# Altium project Auto-Solar-Cleaner.PrjPcb
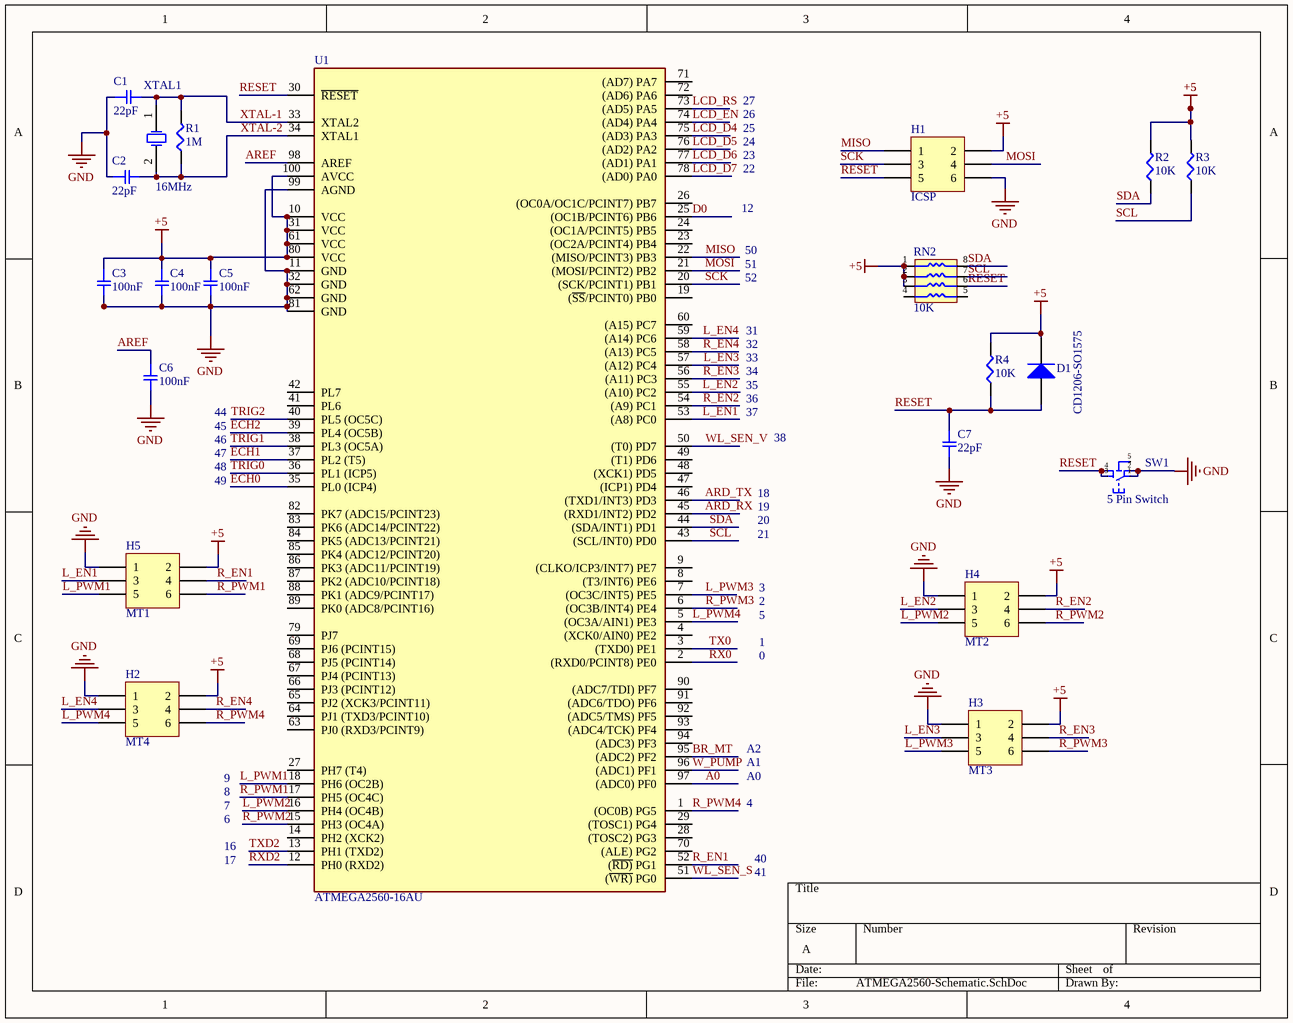
[diagram p0: ATMEGA2560-Schematic.SchDoc]
4 sheets, 90 parts. Net scope: global (net labels, ports and power ports of the same name join across sheets).
Board file: SOLAR_CLEANER_PCB.PcbDoc
Sheets:
  ATMEGA2560-Schematic.SchDoc
  CH340-Sch.SchDoc
  ESP01-Schematic.SchDoc
  Sensors.SchDoc

## Sheet ATMEGA2560-Schematic.SchDoc
size A

### Parts
C1  22pF
C2  22pF
C3  100nF  [SMD-0805C]
C4  100nF  [SMD-0805C]
C5  100nF  [SMD-0805C]
C6  100nF  [SMD-0805C]
C7  22pF  [SMD-0603C]
D1  CD1206-SO1575  [D1206-RD]
H1  ICSP  [HDR2X3]
H2  MT4  [HDR2X3]
H3  MT3  [HDR2X3]
H4  MT2  [HDR2X3]
H5  MT1  [HDR2X3]
R1  1M  [SMD-0805-RES]
R2  10K
R3  10K
R4  10K
RN2  10K  [RA0603-8]
SW1  5 Pin Switch  [SPDT-5Pin]
U1  ATMEGA2560-16AU  [TQFP-100(LCSC)]
XTAL1  16MHz

### Nets
+5: C3.1 C4.1 C5.1 D1.2(K) H1.2 H2.2 H3.2 H4.2 H5.2 R2.2 R3.2 R4.2 RN2.1 RN2.2 RN2.3 U1.10(VCC) U1.31(VCC) U1.61(VCC) U1.80(VCC) U1.100(AVCC)
GND: C1.1 C2.1 C3.2 C4.2 C5.2 C6.2 C7.2 H1.6 H2.1 H3.1 H4.1 H5.1 SW1.1 SW1.2 U1.11(GND) U1.32(GND) U1.62(GND) U1.81(GND) U1.99(AGND)
A0: U1.97((ADC0)_PF0)
ARD_RX: U1.45((RXD1/INT2)_PD2)
ARD_TX: U1.46((TXD1/INT3)_PD3)
AREF: C6.1 U1.98(AREF)
BR_MT: U1.95((ADC2)_PF2)
D0: U1.25((OC1B/PCINT6)_PB6)
ECH0: U1.35(PL0_(ICP4))
ECH1: U1.37(PL2_(T5))
ECH2: U1.39(PL4_(OC5B))
L_EN1: H5.3 U1.53((A8)_PC0)
L_EN2: H4.3 U1.55((A10)_PC2)
L_EN3: H3.3 U1.57((A12)_PC4)
L_EN4: H2.3 U1.59((A14)_PC6)
L_PWM1: H5.5 U1.18(PH6_(OC2B))
L_PWM2: H4.5 U1.16(PH4_(OC4B))
L_PWM3: H3.5 U1.7((OC3C/INT5)_PE5)
L_PWM4: H2.5 U1.5((OC3A/AIN1)_PE3)
LCD_D4: U1.75((AD3)_PA3)
LCD_D5: U1.76((AD2)_PA2)
LCD_D6: U1.77((AD1)_PA1)
LCD_D7: U1.78((AD0)_PA0)
LCD_EN: U1.74((AD4)_PA4)
LCD_RS: U1.73((AD5)_PA5)
MISO: H1.1 U1.22((MISO/PCINT3)_PB3)
MOSI: H1.4 U1.21((MOSI/PCINT2)_PB2)
R_EN1: H5.4 U1.52((~{RD)}_PG1)
R_EN2: H4.4 U1.54((A9)_PC1)
R_EN3: H3.4 U1.56((A11)_PC3)
R_EN4: H2.4 U1.58((A13)_PC5)
R_PWM1: H5.6 U1.17(PH5_(OC4C))
R_PWM2: H4.6 U1.15(PH3_(OC4A))
R_PWM3: H3.6 U1.6((OC3B/INT4)_PE4)
R_PWM4: H2.6 U1.1((OC0B)_PG5)
RESET: C7.1 D1.1(A) H1.5 R4.1 RN2.6 SW1.3 SW1.4 U1.30(~{RESET})
RX0: U1.2((RXD0/PCINT8)_PE0)
RXD2: U1.12(PH0_(RXD2))
SCK: H1.3 U1.20((SCK/PCINT1)_PB1)
SCL: R3.1 RN2.7 U1.43((SCL/INT0)_PD0)
SDA: R2.1 RN2.8 U1.44((SDA/INT1)_PD1)
TRIG0: U1.36(PL1_(ICP5))
TRIG1: U1.38(PL3_(OC5A))
TRIG2: U1.40(PL5_(OC5C))
TX0: U1.3((TXD0)_PE1)
TXD2: U1.13(PH1_(TXD2))
W_PUMP: U1.96((ADC1)_PF1)
WL_SEN_S: U1.51((~{WR)}_PG0)
WL_SEN_V: U1.50((T0)_PD7)
XTAL-1: C1.2 R1.2 U1.33(XTAL2) XTAL1.1(OSC1)
XTAL-2: C2.2 R1.1 U1.34(XTAL1) XTAL1.2(OSC2)

Not connected (* = marked no-connect by the designer): RN2 4 5; SW1 5; U1 4((XCK0/AIN0)_PE2) 8((T3/INT6)_PE6) 9((CLKO/ICP3/INT7)_PE7) 14(PH2_(XCK2)) 19((~{SS}/PCINT0)_PB0) 23((OC2A/PCINT4)_PB4) 24((OC1A/PCINT5)_PB5) 26((OC0A/OC1C/PCINT7)_PB7) 27(PH7_(T4)) 28((TOSC2)_PG3) 29((TOSC1)_PG4) 41(PL6) 42(PL7) 47((ICP1)_PD4) 48((XCK1)_PD5) 49((T1)_PD6) 60((A15)_PC7) 63(PJ0_(RXD3/PCINT9)) 64(PJ1_(TXD3/PCINT10)) 65(PJ2_(XCK3/PCINT11)) 66(PJ3_(PCINT12)) 67(PJ4_(PCINT13)) 68(PJ5_(PCINT14)) 69(PJ6_(PCINT15)) 70((ALE)_PG2) 71((AD7)_PA7) 72((AD6)_PA6) 79(PJ7) 82(PK7_(ADC15/PCINT23)) 83(PK6_(ADC14/PCINT22)) 84(PK5_(ADC13/PCINT21)) 85(PK4_(ADC12/PCINT20)) 86(PK3_(ADC11/PCINT19)) 87(PK2_(ADC10/PCINT18)) 88(PK1_(ADC9/PCINT17)) 89(PK0_(ADC8/PCINT16)) 90((ADC7/TDI)_PF7) 91((ADC6/TDO)_PF6) 92((ADC5/TMS)_PF5) 93((ADC4/TCK)_PF4) 94((ADC3)_PF3)

### Notes on the sheet
- 23
- 24
- 25
- 26
- 27
- 12
- 22
- 52
- 51
- 50
- 33
- 32
- 31
- 45
- 44
- 37
- 36
- 35
- 34
- 49
- 48
- 47
- 46
- 18
- 38
- 21
- 20
- 19
- 5
- 2
- 3
- 0
- 1
- A1
- A2
- 6
- 7
- 8
- 9
- 4
- A0
- 17
- 16
- 41
- 40

### Library data of the parts
C1-C7 = GC321AD72E103KX01D: CAP CER 10000PF 250V X7T 0805; Manufacturer: Murata Electronics North America; Factory Stock: 0; Unit Price (USD): 0.3; Minimum Quantity: 1; Tolerance: ±10%; Datasheets: http://search.murata.co.jp/Ceramy/image/img/A01X/G101/ENG/GC321AD72E103KX01-01.pdf; Image: //media.digikey.com/Renders/Murata%20Renders/0805(GC3)200x125.jpg; Digi-Key Part Number: 490-13986-1-ND; Part Number: GC321AD72E103KX01D; Quantity Available: 4000; @ qty: 0; Packaging: Cut Tape (CT); Series: GC3; Part Status: Active; Value: 10000pF; Voltage: 250V; Temperature Coefficient: X7T; Operating Temperature: -55°C ~ 125°C; Features: -; Ratings: AEC-Q200; Applications: Automotive; Mounting Type: Surface Mount, MLCC; Package / Case: 0805 (2012 Metric); Size / Dimension: 0.079" L x 0.049" W (2.00mm x 1.25mm); Height - Seated (Max): -; Thickness (Max): 0.039" (1.00mm); Lead Spacing: -; Lead Style: -
D1 = Diode: Default Diode; Published: 8-Jun-2000; LatestRevisionDate: 17-Jul-2002; LatestRevisionNote: Re-released for DXP Platform.; PackageVersion: Sep-1996; PackageReference: SMC; Publisher: Altium Limited; PackageDescription: DO-214-AB/SMC; 2 C-Bend Leads; Body 7.9 x 5.9 mm, inc. leads (LxW); Code_JEDEC: DO-214-AB
H1-H5 = Header 3X2: Header, 3-Pin, Dual row; LatestRevisionDate: 17-Jul-2002; LatestRevisionNote: Re-released for DXP Platform.; Publisher: Altium Limited
R1-R4 = ERJ-6BQF1R1V: RES SMD 1.1 OHM 1% 1/3W 0805; Manufacturer: Panasonic Electronic Components; Factory Stock: 0; Unit Price (USD): 0.05834; @ qty: 1500; Minimum Quantity: 1; Value: 1.1; Power (Watts): 0.333W, 1/3W; Temperature Coefficient: ±200ppm/°C; Part Number: ERJ-6BQF1R1V; Datasheets: https://industrial.panasonic.com/cdbs/www-data/pdf/RDA0000/AOA0000C239.pdf; Image: //media.digikey.com/Renders/Panasonic%20Renders/ERJ-0805%20Pkg.jpg; Digi-Key Part Number: P17500CT-ND; Quantity Available: 34000; Packaging: Cut Tape (CT); Series: ERJ; Part Status: Active; Tolerance: ±1%; Composition: Thick Film; Features: Automotive AEC-Q200, Current Sense; Operating Temperature: -55°C ~ 125°C; Package / Case: 0805 (2012 Metric); Supplier Device Package: 0805; Size / Dimension: 0.079" L x 0.049" W (2.00mm x 1.25mm); Height - Seated (Max): 0.028" (0.70mm); Number of Terminations: 2; Failure Rate: -
RN2 = RES_NETWORK: 330 Ohm Â±5% 62.5mW Power Per Element Isolated Resistor Network/Array Â±200ppm/Â°C 1206 _3216 Metric_, Convex, Long Side Terminals; MF: Yageo; MP: YC164-JR-07330RL; Price: None; Availability: Unavailable; SnapEDA_Link: https://www.snapeda.com/parts/YC164-JR-07330RL/Yageo/view-part/106017/?ref=snap; Value: *; Package: 1206 Yageo
SW1 = SPDT-SWITCH
U1 = ATMEGA2560-16AU (LCSC): Integrated Circuit; Manufacturer_Name: Microchip; Height: 1.2mm; Manufacturer_Part_Number: ATMEGA2560-16AU
XTAL1 = Crystal Oscillator: Published: 8-Jun-2000; LatestRevisionDate: 17-Jul-2002; LatestRevisionNote: Re-released for DXP Platform.; PackageReference: R38; Publisher: Altium Limited; PackageDescription: Crystal, Thru-Hole; 2 Leads; Body 3.1 x 8.2 mm (Dia.xH)

## Sheet CH340-Sch.SchDoc
size A
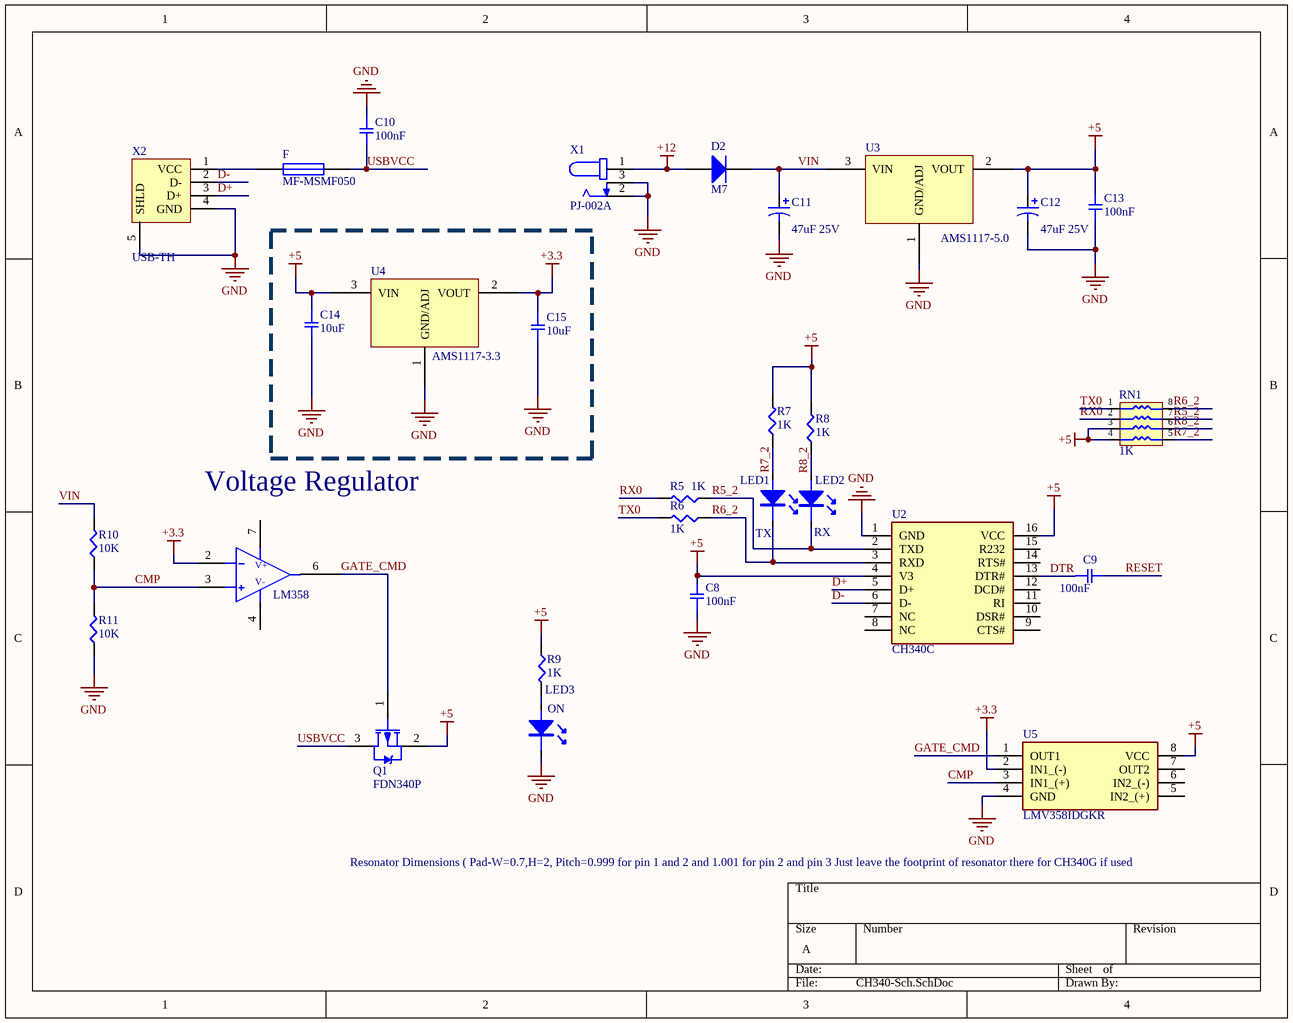
[diagram p1: CH340-Sch.SchDoc]

### Parts
C8  100nF  [SMD-0805C]
C9  100nF  [SMD-0805C]
C10  100nF  [SMD-0805C]
C11  value 47uF 25V  [Elec-Cap-SMD]  (hidden comment: 47uF SMD)
C12  value 47uF 25V  [Elec-Cap-SMD]  (hidden comment: 47uF SMD)
C13  100nF  [SMD-0805C]
C14  10uF  [SMD-0805C]
C15  10uF  [SMD-0805C]
D2  M7  [D0214AC(SMA-2)]
F  MF-MSMF050  [MF-MSMF050-2 (LCSC)]
LED1  TX  [Blue_LED_0805]
LED2  RX  [Blue_LED_0805]
LED3  ON  [RED_LED_0805]
Q1  FDN340P  [SOT-23-3]
R5  1K
R6  1K
R7  1K
R8  1K
R9  1K  [SMD-0805-RES]
R10  10K  [SMD-0805-RES]
R11  10K  [SMD-0805-RES]
RN1  1K  [RA0603-8]
U2  CH340C  [SOIC-16 150MIL(LCSC)]
U3  AMS1117-5.0  [SOT-223]
U4  AMS1117-3.3  [SOT-223]
U5  LMV358IDGKR  [VSSOP-8]
U6  LM358
X1  PJ-002A  [PJ-002A]
X2  USB-TH  [USB-TypeB Female (LCSC)]

### Nets
+3.3: C15.1 U4.2(VOUT) U5.2(IN1_(-)) U6.2(INV)
+5: C8.2 C12.1 C13.2 C14.1 Q1.2(S) R7.2 R8.2 R9.1 RN1.3 RN1.4 U2.4(V3) U2.16(VCC) U3.2(VOUT) U4.3(VIN) U5.8(VCC)
+12: D2.1(A) X1.1
GND: C8.1 C10.2 C11.2 C12.2 C13.1 C14.2 C15.2 LED3.2(K) R11.1 U2.1(GND) U3.1(GND/ADJ) U4.1(GND/ADJ) U5.4(GND) X1.2 X1.3 X2.4(GND) X2.5(SHLD)
CMP: R10.1 R11.2 U5.3(IN1_(+)) U6.3(NON-INV)
D+: U2.5(D+) X2.3(D+)
D-: U2.6(D-) X2.2(D-)
DTR: C9.1 U2.13(DTR#)
GATE_CMD: Q1.1(G) U5.1(OUT1) U6.6(O/P)
R5_2: LED2.2(K) R5.1 RN1.7 U2.2(TXD)
R6_2: LED1.2(K) R6.1 RN1.8 U2.3(RXD)
R7_2: LED1.1(A) R7.1 RN1.5
R8_2: LED2.1(A) R8.1 RN1.6
RESET: C9.2
RX0: R5.2 RN1.2
TX0: R6.2 RN1.1
USBVCC: C10.1 F.2 Q1.3(D)
VIN: C11.1 D2.2(K) R10.2 U3.3(VIN)
NetF_1: F.1 X2.1(VCC)
NetLED3_1: LED3.1(A) R9.2

Not connected (* = marked no-connect by the designer): U2 7(NC) 8(NC) 9(CTS#) 10(DSR#) 11(RI) 12(DCD#) 14(RTS#) 15(R232); U5 5(IN2_(+)) 6(IN2_(-)) 7(OUT2); U6 4(GND) 7(VCC)

### Notes on the sheet
- (near U6) Voltage Regulator
- Resonator Dimensions ( Pad-W=0.7,H=2, Pitch=0.999 for pin 1 and 2 and 1.001 for pin 2 and pin 3 Just leave the footprint of resonator there for CH340G if used
- (in symbol CA3140) V+; V-

### Library data of the parts
C8-C10 C13-C15 = GC321AD72E103KX01D: as C1 on sheet ATMEGA2560-Schematic; Datasheets: http://search.murata.co.jp/Ceramy/image/img/A01X/G101/ENG/GC321AD72E103KX01-01.pdf; Image: //media.digikey.com/Renders/Murata%20Renders/0805(GC3)200x125.jpg; Digi-Key Part Number: 490-13986-1-ND; Part Number: GC321AD72E103KX01D; Quantity Available: 4000; @ qty: 0; Packaging: Cut Tape (CT); Series: GC3; Part Status: Active; Value: 10000pF; Voltage: 250V; Temperature Coefficient: X7T; Operating Temperature: -55°C ~ 125°C; Features: -; Ratings: AEC-Q200; Applications: Automotive; Mounting Type: Surface Mount, MLCC; Package / Case: 0805 (2012 Metric); Size / Dimension: 0.079" L x 0.049" W (2.00mm x 1.25mm); Height - Seated (Max): -; Thickness (Max): 0.039" (1.00mm); Lead Spacing: -; Lead Style: -
C11 C12 = Cap Pol2: Polarized Capacitor (Axial); Published: 8-Jun-2000; LatestRevisionDate: 17-Jul-2002; LatestRevisionNote: Re-released for DXP Platform.; PackageReference: POLAR0.8; Publisher: Altium Limited; PackageDescription: Polarized Capacitor; 2 Leads
D2 = Diode: Default Diode; Published: 8-Jun-2000; LatestRevisionDate: 17-Jul-2002; LatestRevisionNote: Re-released for DXP Platform.; PackageVersion: Sep-1996; PackageReference: SMC; Publisher: Altium Limited; PackageDescription: DO-214-AB/SMC; 2 C-Bend Leads; Body 7.9 x 5.9 mm, inc. leads (LxW); Code_JEDEC: DO-214-AB
F = Fuse 1: Fuse; Published: 8-Jun-2000; LatestRevisionDate: 17-Jul-2002; LatestRevisionNote: Re-released for DXP Platform.; PackageReference: PIN-W2/E2.8; Publisher: Altium Limited; PackageDescription: Thru-Hole; 2 Leads
LED1-LED3 = LED 5V: SMT LED
Q1 = FDN340P: P-Channel  MOSFET SMD CODE=A1SHB; Note: Pin 2 is electrically connected to pin 4.; Published: 8-Jun-2000; LatestRevisionDate: 17-Jul-2002; LatestRevisionNote: Re-released for DXP Platform.; DatasheetVersion: PD-9.814; PackageVersion: Feb-1997; PackageReference: TO-220AB; Publisher: Altium Limited; PackageDescription: TO, Thru-Hole, Vertical, Heatsink Mounted; 3 In-Line Leads; Pitch 2.54 mm; ComponentLink1Description: Manufacturer Link; ComponentLink1URL: http://www.irf.com/
R5-R11 = ERJ-6BQF1R1V: as R1 on sheet ATMEGA2560-Schematic; Part Number: ERJ-6BQF1R1V; Datasheets: https://industrial.panasonic.com/cdbs/www-data/pdf/RDA0000/AOA0000C239.pdf; Image: //media.digikey.com/Renders/Panasonic%20Renders/ERJ-0805%20Pkg.jpg; Digi-Key Part Number: P17500CT-ND; Quantity Available: 34000; Packaging: Cut Tape (CT); Series: ERJ; Part Status: Active; Tolerance: ±1%; Composition: Thick Film; Features: Automotive AEC-Q200, Current Sense; Operating Temperature: -55°C ~ 125°C; Package / Case: 0805 (2012 Metric); Supplier Device Package: 0805; Size / Dimension: 0.079" L x 0.049" W (2.00mm x 1.25mm); Height - Seated (Max): 0.028" (0.70mm); Number of Terminations: 2; Failure Rate: -
RN1 = RES_NETWORK: as RN2 on sheet ATMEGA2560-Schematic; Price: None; Availability: Unavailable; SnapEDA_Link: https://www.snapeda.com/parts/YC164-JR-07330RL/Yageo/view-part/106017/?ref=snap; Value: *; Package: 1206 Yageo
U2 = CH340C: Integrated Circuit; Manufacturer_Name: Maxim Integrated; Manufacturer_Part_Number: DS3231SN#; Datasheet Link: https://datasheets.maximintegrated.com/en/ds/DS3231.pdf; Height: 2.65mm; Mouser Part Number: 700-DS3231SN#; Mouser Price/Stock: https://www.mouser.com/Search/Refine.aspx?Keyword=700-DS3231SN%23; RS Part Number: 1897251; RS Price/Stock: http://uk.rs-online.com/web/p/products/1897251
U3 U4 = AMS1117: AMS1117-3.3, Voltage Regulator
U5 = LM358N: Integrated Circuit; Manufacturer_Name: ON Semiconductor; Datasheet Link: http://www.onsemi.com/pub/Collateral/LM358A-D.pdf; Height: 5.33mm; Manufacturer_Part_Number: LM358N; Arrow Part Number: LM358N; Arrow Price/Stock: https://www.arrow.com/en/products/lm358n/on-semiconductor; Mouser Part Number: 512-LM358N; Mouser Price/Stock: https://www.mouser.co.uk/ProductDetail/ON-Semiconductor-Fairchild/LM358N?qs=K0aVCp%2F7QwafyMXZgr%2FPfw%3D%3D
U6 = CA3140: 4.5MHz BiMOS Op-Amp with Mosfet Input; Published: 8-Jun-2000; LatestRevisionDate: 17-Jul-2002; LatestRevisionNote: Re-released for DXP Platform.; DatasheetVersion: REV. B; PackageVersion: 1990; PackageReference: H-08A; Publisher: Altium Limited; PackageDescription: Can; 8 Leads; Pin Circle Dia. 5.08 mm; Lead Dia. 0.53 mm (max); ComponentLink1Description: Manufacturer Link; ComponentLink1URL: http://www.analog.com/
X1 = PJ-002A: 2,0 x 6,5 mm, 2,5 A, Yatay, AÃ§Ä±k Delik, Dc GÃ¼Ã§ JakÄ± KonnektÃ¶rÃ¼; MF: CUI Devices; Package: None; Price: None; CUI_purchase_URL: https://www.cuidevices.com/product/interconnect/connectors/dc-power-connectors/jacks/pj-002a?utm_source=snapeda.com&utm_medium=referral&utm_campaign=snapedaBOM; SnapEDA_Link: https://www.snapeda.com/parts/PJ-002A/CUI%20Devices/view-part/287588/?ref=snap; Availability: Unavailable; Value: *; MP: PJ-002A
X2 = USB-Type B: USB-Type B Female

## Sheet ESP01-Schematic.SchDoc
size A
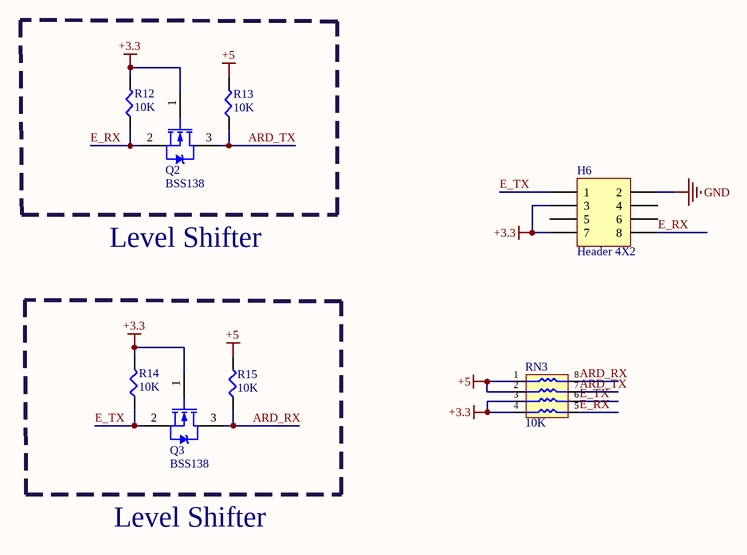
[diagram p2: ESP01-Schematic.SchDoc]

### Parts
H6  Header 4X2  [HDR2X4]
Q2  BSS138  [SMT_TRIODE_NPN]
Q3  BSS138  [SMT_TRIODE_NPN]
R12  10K
R13  10K
R14  10K
R15  10K
RN3  10K  [RA0603-8]

### Nets
+3.3: H6.3 H6.7 Q2.1(G) Q3.1(G) R12.2 R14.2 RN3.3 RN3.4
+5: R13.2 R15.2 RN3.1 RN3.2
GND: H6.2
ARD_RX: Q3.3(D) R15.1 RN3.8
ARD_TX: Q2.3(D) R13.1 RN3.7
E_RX: H6.8 Q2.2(S) R12.1 RN3.5
E_TX: H6.1 Q3.2(S) R14.1 RN3.6

Not connected (* = marked no-connect by the designer): H6 4 5 6

### Notes on the sheet
- Level Shifter

### Library data of the parts
H6 = Header 4X2: Header, 4-Pin, Dual row; LatestRevisionDate: 17-Jul-2002; LatestRevisionNote: Re-released for DXP Platform.; Publisher: Altium Limited
Q2 Q3 = BSS138: N-Channel Power MOSFET; Note: Pin 2 is electrically connected to pin 4.; Published: 8-Jun-2000; LatestRevisionDate: 17-Jul-2002; LatestRevisionNote: Re-released for DXP Platform.; DatasheetVersion: PD-9.814; PackageVersion: Feb-1997; PackageReference: TO-220AB; Publisher: Altium Limited; PackageDescription: TO, Thru-Hole, Vertical, Heatsink Mounted; 3 In-Line Leads; Pitch 2.54 mm; ComponentLink1Description: Manufacturer Link; ComponentLink1URL: http://www.irf.com/
R12-R15 = ERJ-6BQF1R0V: RES SMD 1 OHM 1% 1/3W 0805; Manufacturer: Panasonic Electronic Components; Factory Stock: 0; Unit Price (USD): 0.05834; @ qty: 1500; Minimum Quantity: 1; Value: 1; Power (Watts): 0.333W, 1/3W; Temperature Coefficient: ±200ppm/°C; Part Number: ERJ-6BQF1R0V; Datasheets: https://industrial.panasonic.com/cdbs/www-data/pdf/RDA0000/AOA0000C239.pdf; Image: //media.digikey.com/Renders/Panasonic%20Renders/ERJ-0805%20Pkg.jpg; Digi-Key Part Number: P17499CT-ND; Quantity Available: 808; Packaging: Cut Tape (CT); Series: ERJ; Part Status: Active; Tolerance: ±1%; Composition: Thick Film; Features: Automotive AEC-Q200, Current Sense; Operating Temperature: -55°C ~ 125°C; Package / Case: 0805 (2012 Metric); Supplier Device Package: 0805; Size / Dimension: 0.079" L x 0.049" W (2.00mm x 1.25mm); Height - Seated (Max): 0.028" (0.70mm); Number of Terminations: 2; Failure Rate: -
RN3 = RES_NETWORK: as RN2 on sheet ATMEGA2560-Schematic; Price: None; Availability: Unavailable; SnapEDA_Link: https://www.snapeda.com/parts/YC164-JR-07330RL/Yageo/view-part/106017/?ref=snap; Value: *; Package: 1206 Yageo

## Sheet Sensors.SchDoc
size A
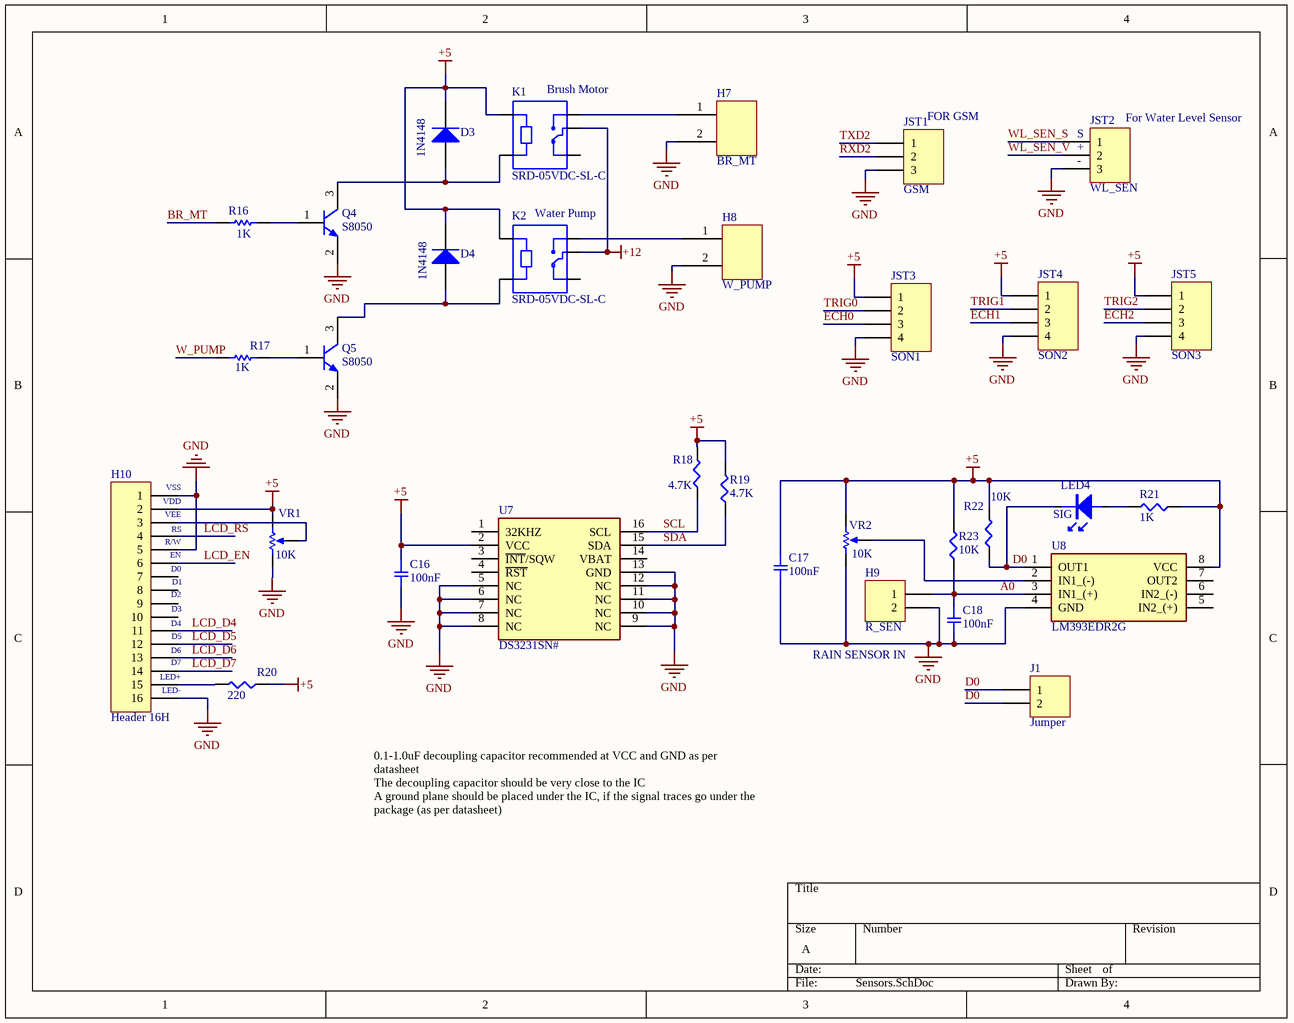
[diagram p3: Sensors.SchDoc]

### Parts
C16  100nF  [SMD-0805C]
C17  100nF  [SMD-0805C]
C18  100nF  [SMD-0805C]
D3  1N4148  [LL4148-L3.7 SMD(LCSC)]
D4  1N4148  [LL4148-L3.7 SMD(LCSC)]
H7  BR_MT  [Header_I2]
H8  W_PUMP  [Header_I2]
H9  R_SEN  [HDR1X2]
H10  Header 16H  [HDR1X16H]
J1  Jumper  [HDR1X2]
JST1  GSM  [HDR1X3]
JST2  WL_SEN  [HDR1X3]
JST3  SON1  [HDR1X4]
JST4  SON2  [HDR1X4]
JST5  SON3  [HDR1X4]
K1  SRD-05VDC-SL-C  [SRD-05VDC-SL-C]
K2  SRD-05VDC-SL-C  [SRD-05VDC-SL-C]
LED4  SIG  [RED_LED_0805]
Q4  S8050  [SMT_TRIODE_NPN]
Q5  S8050  [SMT_TRIODE_NPN]
R16  1K  [SMD-0805-RES]
R17  1K  [SMD-0805-RES]
R18  4.7K  [SMD-0805-RES]
R19  4.7K  [SMD-0805-RES]
R20  220  [SMD-0805-RES]
R21  1K  [SMD-0805-RES]
R22  10K  [SMD-0805-RES]
R23  10K  [SMD-0805-RES]
U7  DS3231SN#  [DS3231(Module-footprint)]
U8  LM393EDR2G  [SOIC-8]
VR1  value 10K  [VR7(LCSC)]  (hidden comment: 10K potentiometer)
VR2  value 10K  [VR7(LCSC)]  (hidden comment: 10K potentiometer)

### Nets
+5: C16.1 C17.1 D3.2(K) D4.2(K) H10.2 JST3.1 JST4.1 JST5.1 K1.A1 K2.A1 R18.2 R19.2 R20.1 R21.1 R22.2 R23.2 U7.2(VCC) U8.8(VCC) VR1.3(TOP) VR2.3(TOP)
+12: K1.COM K2.COM
GND: C16.2 C17.2 C18.2 H7.2 H8.2 H9.2 H10.1 H10.5 H10.16 JST1.3 JST2.3 JST3.4 JST4.4 JST5.4 Q4.2(E) Q5.2(E) U7.5(NC) U7.6(NC) U7.7(NC) U7.8(NC) U7.9(NC) U7.10(NC) U7.11(NC) U7.12(NC) U7.13(GND) U8.4(GND) VR1.1(BOT) VR2.1(BOT)
A0: C18.1 H9.1 R23.1 U8.3(IN1_(+))
BR_MT: R16.1
D0: J1.1 J1.2 LED4.2(K) R22.1 U8.1(OUT1)
ECH0: JST3.3
ECH1: JST4.3
ECH2: JST5.3
LCD_D4: H10.11
LCD_D5: H10.12
LCD_D6: H10.13
LCD_D7: H10.14
LCD_EN: H10.6
LCD_RS: H10.4
RXD2: JST1.2
SCL: R18.1 U7.16(SCL)
SDA: R19.1 U7.15(SDA)
TRIG0: JST3.2
TRIG1: JST4.2
TRIG2: JST5.2
TXD2: JST1.1
W_PUMP: R17.1
WL_SEN_S: JST2.1
WL_SEN_V: JST2.2
NetD3_1: D3.1(A) K1.A2 Q4.3(C)
NetD4_1: D4.1(A) K2.A2 Q5.3(C)
NetH7_1: H7.1 K1.NO
NetH8_1: H8.1 K2.NO
NetH10_3: H10.3 VR1.2(TAP)
NetH10_15: H10.15 R20.2
NetLED4_1: LED4.1(A) R21.2
NetQ4_1: Q4.1(B) R16.2
NetQ5_1: Q5.1(B) R17.2
NetU8_2: U8.2(IN1_(-)) VR2.2(TAP)

Not connected (* = marked no-connect by the designer): H10 7 8 9 10; K1 NC; K2 NC; U7 1(32KHZ) 3(~{INT}/SQW) 4(~{RST}) 14(VBAT); U8 5(IN2_(+)) 6(IN2_(-)) 7(OUT2)

### Notes on the sheet
- (near K1) Brush Motor
- (near JST1) FOR GSM
- (near JST2) S
- (near JST2) +
- (near JST2) -
- (near JST2) For Water Level Sensor
- (near K2) Water Pump
- (near H10) VDD
- (near H10) VSS
- (near H10) VEE
- (near H10) R/W
- (near H10) EN
- (near H10) D0
- (near H10) RS
- (near H10) D4
- (near H10) D2
- (near H10) D5
- (near H10) D3
- (near H10) D1
- (near H10) LED+
- (near H10) LED-
- (near H10) D6
- (near H10) D7
- RAIN SENSOR IN
- 0.1-1.0uF decoupling capacitor recommended at VCC and GND as per datasheet                                                                                                           The decoupling capacitor should be very close to the IC                                              A ground plane should be placed under the IC, if the signal traces go under the package (as per datasheet)

### Library data of the parts
C16-C18 = GC321AD72E103KX01D: as C1 on sheet ATMEGA2560-Schematic; Datasheets: http://search.murata.co.jp/Ceramy/image/img/A01X/G101/ENG/GC321AD72E103KX01-01.pdf; Image: //media.digikey.com/Renders/Murata%20Renders/0805(GC3)200x125.jpg; Digi-Key Part Number: 490-13986-1-ND; Part Number: GC321AD72E103KX01D; Quantity Available: 4000; @ qty: 0; Packaging: Cut Tape (CT); Series: GC3; Part Status: Active; Value: 10000pF; Voltage: 250V; Temperature Coefficient: X7T; Operating Temperature: -55°C ~ 125°C; Features: -; Ratings: AEC-Q200; Applications: Automotive; Mounting Type: Surface Mount, MLCC; Package / Case: 0805 (2012 Metric); Size / Dimension: 0.079" L x 0.049" W (2.00mm x 1.25mm); Height - Seated (Max): -; Thickness (Max): 0.039" (1.00mm); Lead Spacing: -; Lead Style: -
D3 D4 = Diode 1N4148: High Conductance Fast Diode; Published: 8-Jun-2000; LatestRevisionDate: 17-Jul-2002; LatestRevisionNote: Re-released for DXP Platform.; DatasheetVersion: 1997; PackageReference: DO-35; Publisher: Altium Limited; PackageDescription: Diode, Axial; Body 3.8 x 1.9 mm (LxDia. max), Lead Dia. 0.53 mm (max); Code_JEDEC: DO-204-AH; ComponentLink1Description: Manufacturer Link; ComponentLink1URL: http://www.fairchildsemi.com/; ComponentLink2Description: Datasheet; ComponentLink2URL: http://www.fairchildsemi.com/ds/1N%2F1N4148.pdf
H7 H8 = Header_I2: 2-pin single line header (in Blue/green color) Normal; DateCreated: 03/08/2020
H9 J1 = Header 2: Header, 2-Pin; LatestRevisionDate: 17-Jul-2002; LatestRevisionNote: Re-released for DXP Platform.; Publisher: Altium Limited
H10 = Header 16H: Header, 16-Pin, Right Angle; LatestRevisionDate: 17-Jul-2002; LatestRevisionNote: Re-released for DXP Platform.; Publisher: Altium Limited
JST1 JST2 = Header 3: Header, 3-Pin; LatestRevisionDate: 17-Jul-2002; LatestRevisionNote: Re-released for DXP Platform.; Publisher: Altium Limited
JST3-JST5 = Header 4: Header, 4-Pin; LatestRevisionDate: 17-Jul-2002; LatestRevisionNote: Re-released for DXP Platform.; Publisher: Altium Limited
K1 K2 = SRD-05VDC-SL-C: 5V Trigger Relay Module For Arduino And Raspberry Pi 5V Trigger Relay Module For Arduino And Raspberry Pi; MF: Songle Relay; Package: None; Availability: Unavailable; Value: *; MP: SRD-05VDC-SL-C; SnapEDA_Link: https://www.snapeda.com/parts/SRD-05VDC-SL-C/Songle%20Relay/view-part/1029484/?ref=snap; Price: None
LED4 = LED 5V: SMT LED
Q4 Q5 = S8050: S8050 NPN Bipolar Junction Transistor; Published: 8-Jun-2000; LatestRevisionDate: 17-Jul-2002; LatestRevisionNote: Re-released for DXP Platform.; PackageReference: TO-226-AA; Publisher: Altium Limited; PackageDescription: TO, Flat Index; 3 In-Line, Axial Leads; Body Dia. 4.8mm; Leads 0.55 x 0.51 mm (max); Code_JEDEC: TO-226-AA
R16 R17 = Res1: Resistor; Published: 8-Jun-2000; LatestRevisionDate: 17-Jul-2002; LatestRevisionNote: Re-released for DXP Platform.; PackageReference: AXIAL-0.3; Publisher: Altium Limited; PackageDescription: Axial Device, Thru-Hole; 2 Leads; 0.3 in Pin Spacing; Value: 1K
R18-R23 = ERJ-6BQF1R0V: as R12 on sheet ESP01-Schematic; Part Number: ERJ-6BQF1R0V; Datasheets: https://industrial.panasonic.com/cdbs/www-data/pdf/RDA0000/AOA0000C239.pdf; Image: //media.digikey.com/Renders/Panasonic%20Renders/ERJ-0805%20Pkg.jpg; Digi-Key Part Number: P17499CT-ND; Quantity Available: 808; Packaging: Cut Tape (CT); Series: ERJ; Part Status: Active; Tolerance: ±1%; Composition: Thick Film; Features: Automotive AEC-Q200, Current Sense; Operating Temperature: -55°C ~ 125°C; Package / Case: 0805 (2012 Metric); Supplier Device Package: 0805; Size / Dimension: 0.079" L x 0.049" W (2.00mm x 1.25mm); Height - Seated (Max): 0.028" (0.70mm); Number of Terminations: 2; Failure Rate: -
U7 = DS3231SN#: Real Time Clock IC; Manufacturer_Name: Maxim Integrated; Datasheet Link: https://datasheets.maximintegrated.com/en/ds/DS3231.pdf; Height: 2.65mm; Manufacturer_Part_Number: DS3231SN#; Mouser Part Number: 700-DS3231SN#; Mouser Price/Stock: https://www.mouser.com/Search/Refine.aspx?Keyword=700-DS3231SN%23; RS Part Number: 1897251; RS Price/Stock: http://uk.rs-online.com/web/p/products/1897251
U8 = LM358N: as U5 on sheet CH340-Sch; Datasheet Link: http://www.onsemi.com/pub/Collateral/LM358A-D.pdf; Height: 5.33mm; Manufacturer_Part_Number: LM358N; Arrow Part Number: LM358N; Arrow Price/Stock: https://www.arrow.com/en/products/lm358n/on-semiconductor; Mouser Part Number: 512-LM358N; Mouser Price/Stock: https://www.mouser.co.uk/ProductDetail/ON-Semiconductor-Fairchild/LM358N?qs=K0aVCp%2F7QwafyMXZgr%2FPfw%3D%3D
VR1 VR2 = RPot: Potentiometer; Sim Note: Enter the Resistance value and the set point into parameter fields.; Set Position: 0.5; Published: 8-Jun-2000; LatestRevisionDate: 17-Jul-2002; LatestRevisionNote: Re-released for DXP Platform.; PackageReference: VR5; Publisher: Altium Limited; PackageDescription: Variable Resistor, Thru-Hole; 3 Leads

## Nets that join several sheets
+3.3: CH340-Sch (C15.1 U4.2 U5.2 U6.2), ESP01-Schematic (8 pins)
+5: ATMEGA2560-Schematic (20 pins), CH340-Sch (15 pins), ESP01-Schematic (R13.2 R15.2 RN3.1 RN3.2), Sensors (20 pins)
+12: CH340-Sch (D2.1 X1.1), Sensors (K1.COM K2.COM)
GND: ATMEGA2560-Schematic (19 pins), CH340-Sch (17 pins), ESP01-Schematic (H6.2), Sensors (28 pins)
A0: ATMEGA2560-Schematic (U1.97), Sensors (C18.1 H9.1 R23.1 U8.3)
ARD_RX: ATMEGA2560-Schematic (U1.45), ESP01-Schematic (Q3.3 R15.1 RN3.8)
ARD_TX: ATMEGA2560-Schematic (U1.46), ESP01-Schematic (Q2.3 R13.1 RN3.7)
BR_MT: ATMEGA2560-Schematic (U1.95), Sensors (R16.1)
D0: ATMEGA2560-Schematic (U1.25), Sensors (5 pins)
ECH0: ATMEGA2560-Schematic (U1.35), Sensors (JST3.3)
ECH1: ATMEGA2560-Schematic (U1.37), Sensors (JST4.3)
ECH2: ATMEGA2560-Schematic (U1.39), Sensors (JST5.3)
LCD_D4: ATMEGA2560-Schematic (U1.75), Sensors (H10.11)
LCD_D5: ATMEGA2560-Schematic (U1.76), Sensors (H10.12)
LCD_D6: ATMEGA2560-Schematic (U1.77), Sensors (H10.13)
LCD_D7: ATMEGA2560-Schematic (U1.78), Sensors (H10.14)
LCD_EN: ATMEGA2560-Schematic (U1.74), Sensors (H10.6)
LCD_RS: ATMEGA2560-Schematic (U1.73), Sensors (H10.4)
RESET: ATMEGA2560-Schematic (8 pins), CH340-Sch (C9.2)
RX0: ATMEGA2560-Schematic (U1.2), CH340-Sch (R5.2 RN1.2)
RXD2: ATMEGA2560-Schematic (U1.12), Sensors (JST1.2)
SCL: ATMEGA2560-Schematic (R3.1 RN2.7 U1.43), Sensors (R18.1 U7.16)
SDA: ATMEGA2560-Schematic (R2.1 RN2.8 U1.44), Sensors (R19.1 U7.15)
TRIG0: ATMEGA2560-Schematic (U1.36), Sensors (JST3.2)
TRIG1: ATMEGA2560-Schematic (U1.38), Sensors (JST4.2)
TRIG2: ATMEGA2560-Schematic (U1.40), Sensors (JST5.2)
TX0: ATMEGA2560-Schematic (U1.3), CH340-Sch (R6.2 RN1.1)
TXD2: ATMEGA2560-Schematic (U1.13), Sensors (JST1.1)
W_PUMP: ATMEGA2560-Schematic (U1.96), Sensors (R17.1)
WL_SEN_S: ATMEGA2560-Schematic (U1.51), Sensors (JST2.1)
WL_SEN_V: ATMEGA2560-Schematic (U1.50), Sensors (JST2.2)